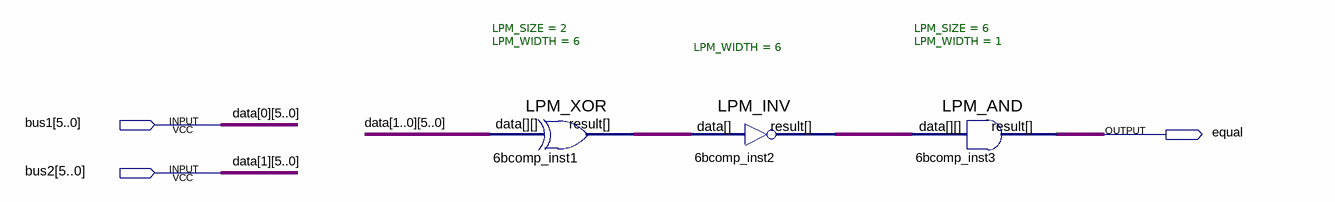
[diagram p0: schematic sheet]
// Quartus schematic 6b_comp.bdf as structural Verilog: 3 symbols, 3 pins
module \6b_comp  (
  input  [5:0] bus1,
  input  [5:0] bus2,
  output equal
);

  wire [5:0] n6bcomp_inst1_result, n6bcomp_inst2_result;

  LPM_XOR #(.LPM_SIZE(2), .LPM_WIDTH(6)) u_6bcomp_inst1 (.data({bus2, bus1}), .result(n6bcomp_inst1_result));
  LPM_INV #(.LPM_WIDTH(6)) u_6bcomp_inst2 (.data(n6bcomp_inst1_result), .result(n6bcomp_inst2_result));
  LPM_AND #(.LPM_SIZE(6), .LPM_WIDTH(1)) u_6bcomp_inst3 (.data(n6bcomp_inst2_result), .result(equal));

  // Other names for the same wires on the sheet: data_0[5:0] = bus1; data_1[5:0] = bus2
endmodule
